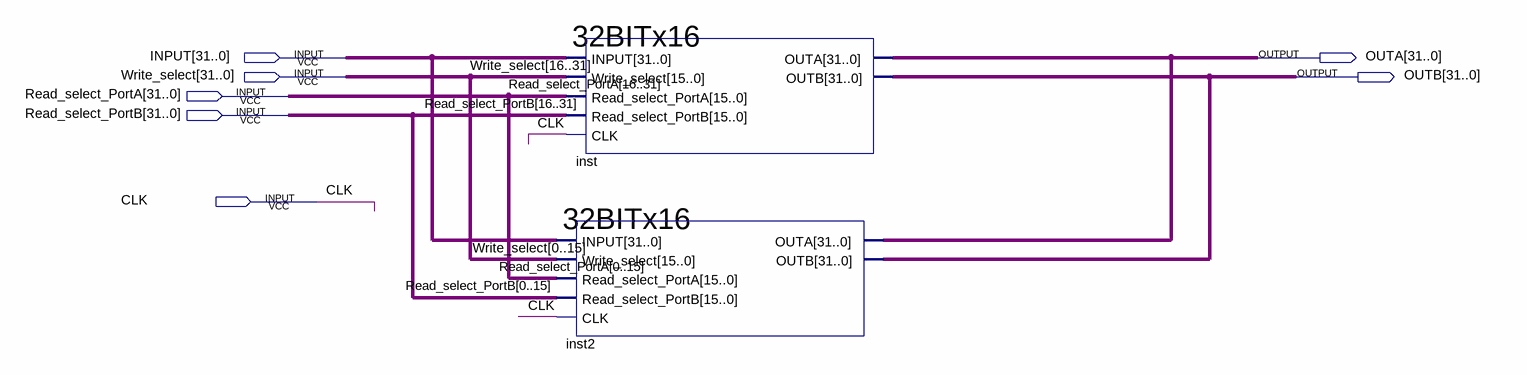
[diagram p0: schematic sheet]
// Quartus schematic 32x32.bdf as structural Verilog: 2 symbols, 7 pins
module \32x32  (
  input  [31:0] INPUT,
  input  [31:0] Write_select,
  input  [31:0] Read_select_PortA,
  input  [31:0] Read_select_PortB,
  input  CLK,
  output [31:0] OUTA,
  output [31:0] OUTB
);

  \32BITx16  inst (
    .INPUT(INPUT),
    .Write_select({Write_select[16], Write_select[17], Write_select[18], Write_select[19], Write_select[20], Write_select[21], Write_select[22], Write_select[23], Write_select[24], Write_select[25], Write_select[26], Write_select[27], Write_select[28], Write_select[29], Write_select[30], Write_select[31]}),
    .Read_select_PortA({Read_select_PortA[16], Read_select_PortA[17], Read_select_PortA[18], Read_select_PortA[19], Read_select_PortA[20], Read_select_PortA[21], Read_select_PortA[22], Read_select_PortA[23], Read_select_PortA[24], Read_select_PortA[25], Read_select_PortA[26], Read_select_PortA[27], Read_select_PortA[28], Read_select_PortA[29], Read_select_PortA[30], Read_select_PortA[31]}),
    .Read_select_PortB({Read_select_PortB[16], Read_select_PortB[17], Read_select_PortB[18], Read_select_PortB[19], Read_select_PortB[20], Read_select_PortB[21], Read_select_PortB[22], Read_select_PortB[23], Read_select_PortB[24], Read_select_PortB[25], Read_select_PortB[26], Read_select_PortB[27], Read_select_PortB[28], Read_select_PortB[29], Read_select_PortB[30], Read_select_PortB[31]}),
    .CLK(CLK), .OUTA(OUTA), .OUTB(OUTB));
  \32BITx16  inst2 (
    .INPUT(INPUT),
    .Write_select({Write_select[0], Write_select[1], Write_select[2], Write_select[3], Write_select[4], Write_select[5], Write_select[6], Write_select[7], Write_select[8], Write_select[9], Write_select[10], Write_select[11], Write_select[12], Write_select[13], Write_select[14], Write_select[15]}),
    .Read_select_PortA({Read_select_PortA[0], Read_select_PortA[1], Read_select_PortA[2], Read_select_PortA[3], Read_select_PortA[4], Read_select_PortA[5], Read_select_PortA[6], Read_select_PortA[7], Read_select_PortA[8], Read_select_PortA[9], Read_select_PortA[10], Read_select_PortA[11], Read_select_PortA[12], Read_select_PortA[13], Read_select_PortA[14], Read_select_PortA[15]}),
    .Read_select_PortB({Read_select_PortB[0], Read_select_PortB[1], Read_select_PortB[2], Read_select_PortB[3], Read_select_PortB[4], Read_select_PortB[5], Read_select_PortB[6], Read_select_PortB[7], Read_select_PortB[8], Read_select_PortB[9], Read_select_PortB[10], Read_select_PortB[11], Read_select_PortB[12], Read_select_PortB[13], Read_select_PortB[14], Read_select_PortB[15]}),
    .CLK(CLK), .OUTA(OUTA), .OUTB(OUTB));
endmodule
